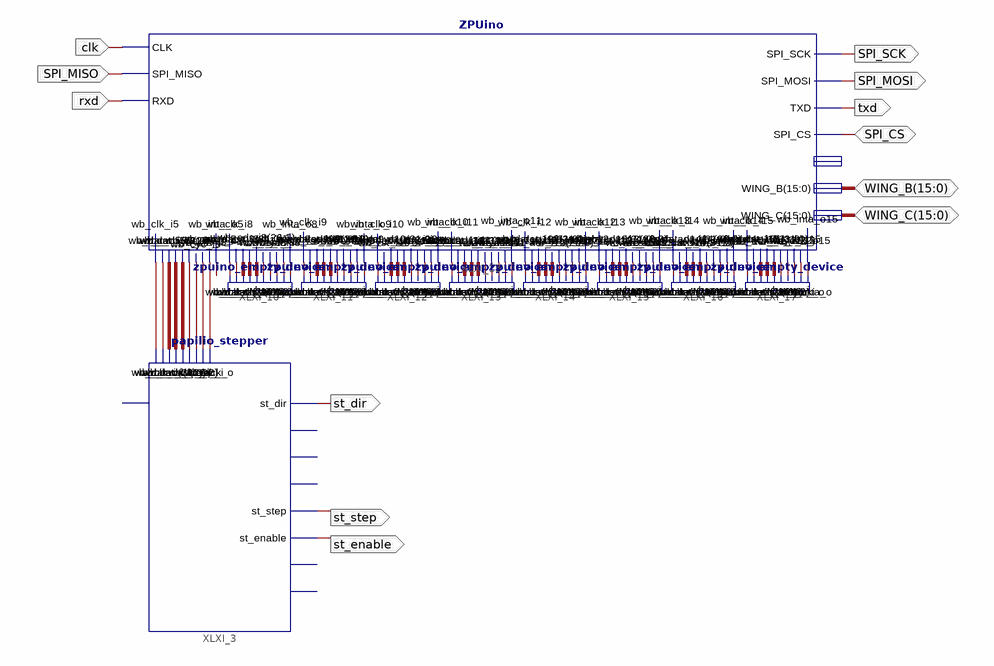
[diagram p0: schematic sheet 1]
// Xilinx ISE schematic papilio_SOC_schematic.sch (spartan3e) as structural Verilog: 10 symbols, 12 ports
module papilio_SOC_schematic (
  input  clk,
  input  SPI_MISO,
  input  rxd,
  inout  SPI_CS,
  inout  [15:0] WING_B,
  inout  [15:0] WING_C,
  output txd,
  output SPI_MOSI,
  output SPI_SCK,
  output st_dir,
  output st_step,
  output st_enable
);

  wire XLXN_146, XLXN_147, XLXN_151, XLXN_152, XLXN_153, XLXN_154, XLXN_155, XLXN_159, XLXN_160, XLXN_164,
       XLXN_165, XLXN_166, XLXN_167, XLXN_168, XLXN_169, XLXN_170, XLXN_174, XLXN_175, XLXN_176, XLXN_177,
       XLXN_178, XLXN_179, XLXN_180, XLXN_184, XLXN_185, XLXN_186, XLXN_187, XLXN_188, XLXN_189, XLXN_190,
       XLXN_194, XLXN_195, XLXN_196, XLXN_197, XLXN_198, XLXN_199, XLXN_200, XLXN_204, XLXN_205, XLXN_206,
       XLXN_207, XLXN_208, XLXN_209, XLXN_210, XLXN_214, XLXN_215, XLXN_216, XLXN_217, XLXN_218, XLXN_219,
       XLXN_220, XLXN_224, XLXN_225, XLXN_226, XLXN_227, XLXN_228, XLXN_229, XLXN_230, XLXN_234, XLXN_235,
       XLXN_236, XLXN_237, XLXN_238;
  wire [26:2] XLXN_150, XLXN_163, XLXN_173, XLXN_183, XLXN_193, XLXN_203, XLXN_213, XLXN_223, XLXN_233;
  wire [31:0] XLXN_148, XLXN_149, XLXN_161, XLXN_162, XLXN_171, XLXN_172, XLXN_181, XLXN_182, XLXN_191,
       XLXN_192, XLXN_201, XLXN_202, XLXN_211, XLXN_212, XLXN_221, XLXN_222, XLXN_231, XLXN_232;

  zpuino_empty_device XLXI_10 (
    .wb_clk_i(XLXN_159), .wb_rst_i(XLXN_160), .wb_dat_o(XLXN_161), .wb_dat_i(XLXN_162), .wb_adr_i(XLXN_163),
    .wb_we_i(XLXN_164), .wb_cyc_i(XLXN_165), .wb_stb_i(XLXN_166), .wb_ack_o(XLXN_167), .wb_inta_o(XLXN_168));
  zpuino_empty_device XLXI_11 (
    .wb_clk_i(XLXN_169), .wb_rst_i(XLXN_170), .wb_dat_o(XLXN_171), .wb_dat_i(XLXN_172), .wb_adr_i(XLXN_173),
    .wb_we_i(XLXN_174), .wb_cyc_i(XLXN_175), .wb_stb_i(XLXN_176), .wb_ack_o(XLXN_177), .wb_inta_o(XLXN_178));
  zpuino_empty_device XLXI_12 (
    .wb_clk_i(XLXN_179), .wb_rst_i(XLXN_180), .wb_dat_o(XLXN_181), .wb_dat_i(XLXN_182), .wb_adr_i(XLXN_183),
    .wb_we_i(XLXN_184), .wb_cyc_i(XLXN_185), .wb_stb_i(XLXN_186), .wb_ack_o(XLXN_187), .wb_inta_o(XLXN_188));
  zpuino_empty_device XLXI_13 (
    .wb_clk_i(XLXN_189), .wb_rst_i(XLXN_190), .wb_dat_o(XLXN_191), .wb_dat_i(XLXN_192), .wb_adr_i(XLXN_193),
    .wb_we_i(XLXN_194), .wb_cyc_i(XLXN_195), .wb_stb_i(XLXN_196), .wb_ack_o(XLXN_197), .wb_inta_o(XLXN_198));
  zpuino_empty_device XLXI_14 (
    .wb_clk_i(XLXN_199), .wb_rst_i(XLXN_200), .wb_dat_o(XLXN_201), .wb_dat_i(XLXN_202), .wb_adr_i(XLXN_203),
    .wb_we_i(XLXN_204), .wb_cyc_i(XLXN_205), .wb_stb_i(XLXN_206), .wb_ack_o(XLXN_207), .wb_inta_o(XLXN_208));
  zpuino_empty_device XLXI_15 (
    .wb_clk_i(XLXN_209), .wb_rst_i(XLXN_210), .wb_dat_o(XLXN_211), .wb_dat_i(XLXN_212), .wb_adr_i(XLXN_213),
    .wb_we_i(XLXN_214), .wb_cyc_i(XLXN_215), .wb_stb_i(XLXN_216), .wb_ack_o(XLXN_217), .wb_inta_o(XLXN_218));
  zpuino_empty_device XLXI_16 (
    .wb_clk_i(XLXN_219), .wb_rst_i(XLXN_220), .wb_dat_o(XLXN_221), .wb_dat_i(XLXN_222), .wb_adr_i(XLXN_223),
    .wb_we_i(XLXN_224), .wb_cyc_i(XLXN_225), .wb_stb_i(XLXN_226), .wb_ack_o(XLXN_227), .wb_inta_o(XLXN_228));
  zpuino_empty_device XLXI_17 (
    .wb_clk_i(XLXN_229), .wb_rst_i(XLXN_230), .wb_dat_o(XLXN_231), .wb_dat_i(XLXN_232), .wb_adr_i(XLXN_233),
    .wb_we_i(XLXN_234), .wb_cyc_i(XLXN_235), .wb_stb_i(XLXN_236), .wb_ack_o(XLXN_237), .wb_inta_o(XLXN_238));
  ZPUino XLXI_18 (
    .CLK(clk), .SPI_MISO(SPI_MISO), .RXD(rxd), .wb_clk_i5(XLXN_146), .wb_rst_i5(XLXN_147),
    .wb_dat_o5(XLXN_148), .wb_dat_i5(XLXN_149), .wb_adr_i5(XLXN_150), .wb_we_i5(XLXN_151),
    .wb_cyc_i5(XLXN_152), .wb_stb_i5(XLXN_153), .wb_ack_o5(XLXN_154), .wb_inta_o5(XLXN_155),
    .wb_clk_i8(XLXN_159), .wb_rst_i8(XLXN_160), .wb_dat_o8(XLXN_161), .wb_dat_i8(XLXN_162),
    .wb_adr_i8(XLXN_163), .wb_we_i8(XLXN_164), .wb_cyc_i8(XLXN_165), .wb_stb_i8(XLXN_166),
    .wb_ack_o8(XLXN_167), .wb_inta_o8(XLXN_168), .wb_clk_i9(XLXN_169), .wb_rst_i9(XLXN_170),
    .wb_dat_o9(XLXN_171), .wb_dat_i9(XLXN_172), .wb_adr_i9(XLXN_173), .wb_we_i9(XLXN_174),
    .wb_cyc_i9(XLXN_175), .wb_stb_i9(XLXN_176), .wb_ack_o9(XLXN_177), .wb_inta_o9(XLXN_178),
    .wb_clk_i10(XLXN_179), .wb_rst_i10(XLXN_180), .wb_dat_o10(XLXN_181), .wb_dat_i10(XLXN_182),
    .wb_adr_i10(XLXN_183), .wb_we_i10(XLXN_184), .wb_cyc_i10(XLXN_185), .wb_stb_i10(XLXN_186),
    .wb_ack_o10(XLXN_187), .wb_inta_o10(XLXN_188), .wb_clk_i11(XLXN_189), .wb_rst_i11(XLXN_190),
    .wb_dat_o11(XLXN_191), .wb_dat_i11(XLXN_192), .wb_adr_i11(XLXN_193), .wb_we_i11(XLXN_194),
    .wb_cyc_i11(XLXN_195), .wb_stb_i11(XLXN_196), .wb_ack_o11(XLXN_197), .wb_inta_o11(XLXN_198),
    .wb_clk_i12(XLXN_199), .wb_rst_i12(XLXN_200), .wb_dat_o12(XLXN_201), .wb_dat_i12(XLXN_202),
    .wb_adr_i12(XLXN_203), .wb_we_i12(XLXN_204), .wb_cyc_i12(XLXN_205), .wb_stb_i12(XLXN_206),
    .wb_ack_o12(XLXN_207), .wb_inta_o12(XLXN_208), .wb_clk_i13(XLXN_209), .wb_rst_i13(XLXN_210),
    .wb_dat_o13(XLXN_211), .wb_dat_i13(XLXN_212), .wb_adr_i13(XLXN_213), .wb_we_i13(XLXN_214),
    .wb_cyc_i13(XLXN_215), .wb_stb_i13(XLXN_216), .wb_ack_o13(XLXN_217), .wb_inta_o13(XLXN_218),
    .wb_clk_i14(XLXN_219), .wb_rst_i14(XLXN_220), .wb_dat_o14(XLXN_221), .wb_dat_i14(XLXN_222),
    .wb_adr_i14(XLXN_223), .wb_we_i14(XLXN_224), .wb_cyc_i14(XLXN_225), .wb_stb_i14(XLXN_226),
    .wb_ack_o14(XLXN_227), .wb_inta_o14(XLXN_228), .wb_clk_i15(XLXN_229), .wb_rst_i15(XLXN_230),
    .wb_dat_o15(XLXN_231), .wb_dat_i15(XLXN_232), .wb_adr_i15(XLXN_233), .wb_we_i15(XLXN_234),
    .wb_cyc_i15(XLXN_235), .wb_stb_i15(XLXN_236), .wb_ack_o15(XLXN_237), .wb_inta_o15(XLXN_238),
    .SPI_SCK(SPI_SCK), .SPI_MOSI(SPI_MOSI), .TXD(txd), .SPI_CS(SPI_CS), .WING_B(WING_B), .WING_C(WING_C));  // open: WING_A
  papilio_stepper XLXI_3 (
    .st_dir(st_dir), .st_step(st_step), .st_enable(st_enable), .wb_clk_i(XLXN_146), .wb_dat_o(XLXN_148),
    .wb_dat_i(XLXN_149), .wb_rst_i(XLXN_147), .wb_adr_i(XLXN_150), .wb_we_i(XLXN_151), .wb_cyc_i(XLXN_152),
    .wb_stb_i(XLXN_153), .wb_ack_o(XLXN_154));  // open: st_ms2, st_ms1, st_rst, st_sleep, st_irq, st_home
endmodule
